# Altium project Discipulo.PrjPcb
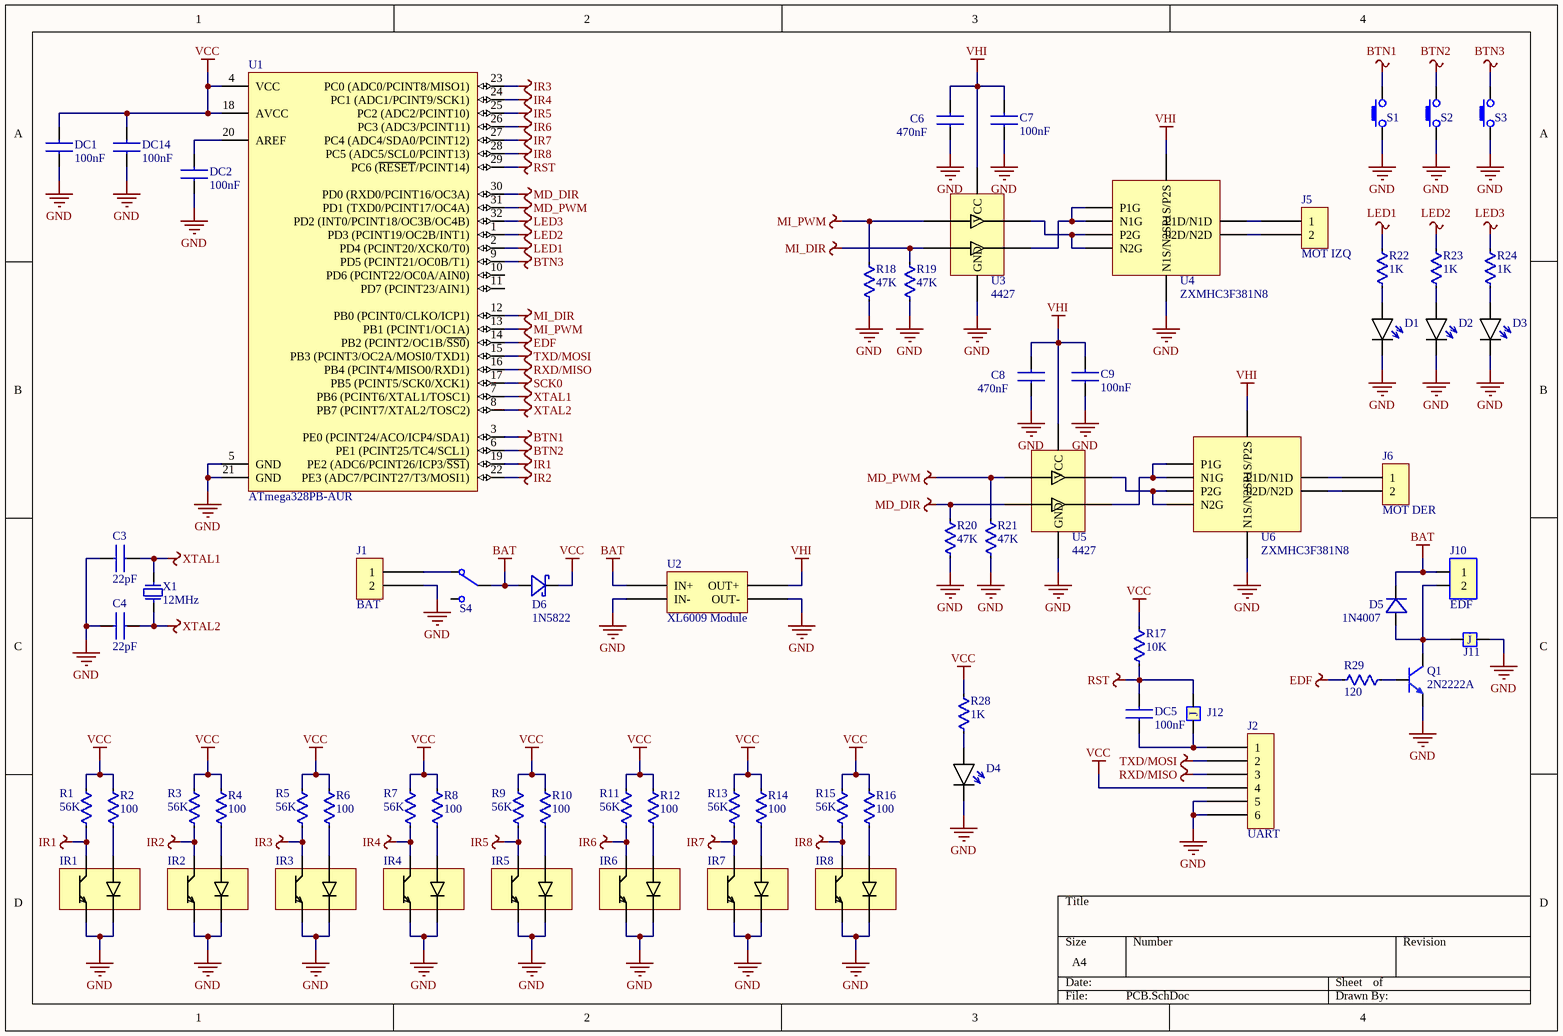
[diagram p0: PCB.SchDoc]
1 sheet, 69 parts. Net scope: global (net labels, ports and power ports of the same name join across sheets).
Board files: PCB.PcbDoc, PCB v2.PcbDoc, PCB v3.PcbDoc

## Sheet PCB.SchDoc
size A4

### Parts
C3  value 22pF  [C1206]  (hidden comment: CAP-CER)
C4  value 22pF  [C1206]  (hidden comment: CAP-CER)
C6  value 470nF  [C1206]  (hidden comment: CAP-CER)
C7  value 100nF  [C1206]  (hidden comment: CAP-CER)
C8  value 470nF  [C1206]  (hidden comment: CAP-CER)
C9  value 100nF  [C1206]  (hidden comment: CAP-CER)
D1  LED  [LED-3MM-YELLOW]  (value not drawn)
D2  LED  [LED-3MM-YELLOW]  (value not drawn)
D3  LED  [LED-3MM-YELLOW]  (value not drawn)
D4  LED  [LED-3MM-RED]  (value not drawn)
D5  NAME: 1N4007  [DO-41]  (hidden comment: DIODE)
D6  1N5822  [DO-41]
DC1  value 100nF  [C1206]  (hidden comment: CAP-CER)
DC2  value 100nF  [C1206]  (hidden comment: CAP-CER)
DC5  value 100nF  [C1206]  (hidden comment: CAP-CER)
DC14  value 100nF  [C1206]  (hidden comment: CAP-CER)
IR1  QRE1113GR  [QRE1113GR]  (value not drawn)
IR2  QRE1113GR  [QRE1113GR]  (value not drawn)
IR3  QRE1113GR  [QRE1113GR]  (value not drawn)
IR4  QRE1113GR  [QRE1113GR]  (value not drawn)
IR5  QRE1113GR  [QRE1113GR]  (value not drawn)
IR6  QRE1113GR  [QRE1113GR]  (value not drawn)
IR7  QRE1113GR  [QRE1113GR]  (value not drawn)
IR8  QRE1113GR  [QRE1113GR]  (value not drawn)
J1  BAT  [HEADER 1x2]
J2  UART  [Header 1x6]
J5  MOT IZQ  [HEADER 1x2]
J6  MOT DER  [HEADER 1x2]
J10  EDF  [BLOCK_TERMINAL-2]
J11  JUMPER  [JUMPER]  (value not drawn)
J12  JUMPER  [JUMPER]  (value not drawn)
Q1  2N2222A  [TO-92]
R1  value 56K  [R1206]  (hidden comment: RES)
R2  value 100  [R1206]  (hidden comment: RES)
R3  value 56K  [R1206]  (hidden comment: RES)
R4  value 100  [R1206]  (hidden comment: RES)
R5  value 56K  [R1206]  (hidden comment: RES)
R6  value 100  [R1206]  (hidden comment: RES)
R7  value 56K  [R1206]  (hidden comment: RES)
R8  value 100  [R1206]  (hidden comment: RES)
R9  value 56K  [R1206]  (hidden comment: RES)
R10  value 100  [R1206]  (hidden comment: RES)
R11  value 56K  [R1206]  (hidden comment: RES)
R12  value 100  [R1206]  (hidden comment: RES)
R13  value 56K  [R1206]  (hidden comment: RES)
R14  value 100  [R1206]  (hidden comment: RES)
R15  value 56K  [R1206]  (hidden comment: RES)
R16  value 100  [R1206]  (hidden comment: RES)
R17  value 10K  [R1206]  (hidden comment: RES)
R18  value 47K  [R1206]  (hidden comment: RES)
R19  value 47K  [R1206]  (hidden comment: RES)
R20  value 47K  [R1206]  (hidden comment: RES)
R21  value 47K  [R1206]  (hidden comment: RES)
R22  value 1K  [R1206]  (hidden comment: RES)
R23  value 1K  [R1206]  (hidden comment: RES)
R24  value 1K  [R1206]  (hidden comment: RES)
R28  value 1K  [R1206]  (hidden comment: RES)
R29  value 120  [R1206]  (hidden comment: RES)
S1  BUTTON  [TACT_SWITCH-SMALL-4PIN]  (value not drawn)
S2  BUTTON  [TACT_SWITCH-SMALL-4PIN]  (value not drawn)
S3  BUTTON  [TACT_SWITCH-SMALL-4PIN]  (value not drawn)
S4  SLIDE-SWITCH  [SWITCH]  (value not drawn)
U1  ATmega328PB-AUR  [32A_M]
U2  XL6009 Module  [XL6009 mdl]
U3  4427  [SOIC-8]
U4  ZXMHC3F381N8  [SOIC-8]
U5  4427  [SOIC-8]
U6  ZXMHC3F381N8  [SOIC-8]
X1  FREQUENCY: 12MHz  [HC-49/S]  (hidden comment: XTAL)

### Nets
BAT: D5.K D6.A J10.1 S4.2 U2.0(IN+)
BTN1: S1.2 U1.3(PE0_(PCINT24/ACO/ICP4/SDA1))
BTN2: S2.2 U1.6(PE1_(PCINT25/TC4/SCL1))
BTN3: S3.2 U1.9(PD5_(PCINT21/OC0B/T1))
EDF: R29.1 U1.14(PB2_(PCINT2/OC1B/~{SS0}))
GND: C3.1 C4.1 C6.1 C7.1 C8.1 C9.1 D1.K D2.K D3.K D4.K DC1.2 DC2.2 DC14.1 IR1.E IR1.K IR2.E IR2.K IR3.E IR3.K IR4.E IR4.K IR5.E IR5.K IR6.E IR6.K IR7.E IR7.K IR8.E IR8.K J1.2 J2.5 J2.6 J11.1 Q1.E R18.1 R19.1 R20.1 R21.1 S1.1 S2.1 S3.1 U1.5(GND) U1.21(GND) U2.1(IN-) U2.2(OUT-) U3.3(GND) U4.3(N1S/N2S) U5.3(GND) U6.3(N1S/N2S)
IR1: IR1.C R1.1 U1.19(PE2_(ADC6/PCINT26/ICP3/~{SS1}))
IR2: IR2.C R3.1 U1.22(PE3_(ADC7/PCINT27/T3/MOSI1))
IR3: IR3.C R5.1 U1.23(PC0_(ADC0/PCINT8/MISO1))
IR4: IR4.C R7.1 U1.24(PC1_(ADC1/PCINT9/SCK1))
IR5: IR5.C R9.1 U1.25(PC2_(ADC2/PCINT10))
IR6: IR6.C R11.1 U1.26(PC3_(ADC3/PCINT11))
IR7: IR7.C R13.1 U1.27(PC4_(ADC4/SDA0/PCINT12))
IR8: IR8.C R15.1 U1.28(PC5_(ADC5/SCL0/PCINT13))
LED1: R22.2 U1.2(PD4_(PCINT20/XCK0/T0))
LED2: R23.2 U1.1(PD3_(PCINT19/OC2B/INT1))
LED3: R24.2 U1.32(PD2_(INT0/PCINT18/OC3B/OC4B))
MD_DIR: R20.2 U1.30(PD0_(RXD0/PCINT16/OC3A)) U5.4(INB)
MD_PWM: R21.2 U1.31(PD1_(TXD0/PCINT17/OC4A)) U5.2(INA)
MI_DIR: R19.2 U1.12(PB0_(PCINT0/CLKO/ICP1)) U3.4(INB)
MI_PWM: R18.2 U1.13(PB1_(PCINT1/OC1A)) U3.2(INA)
RST: DC5.1 J12.1 R17.1 U1.29(PC6_(~{RESET}/PCINT14))
RXD/MISO: J2.3 U1.16(PB4_(PCINT4/MISO0/RXD1))
SCK0: U1.17(PB5_(PCINT5/SCK0/XCK1))
TXD/MOSI: J2.2 U1.15(PB3_(PCINT3/OC2A/MOSI0/TXD1))
VCC: D6.K DC1.1 DC14.2 J2.4 R1.2 R2.2 R3.2 R4.2 R5.2 R6.2 R7.2 R8.2 R9.2 R10.2 R11.2 R12.2 R13.2 R14.2 R15.2 R16.2 R17.2 R28.2 U1.4(VCC) U1.18(AVCC)
VHI: C6.2 C7.2 C8.2 C9.2 U2.3(OUT+) U3.6(VCC) U4.7(P1S/P2S) U5.6(VCC) U6.7(P1S/P2S)
XTAL1: C3.2 U1.7(PB6_(PCINT6/XTAL1/TOSC1)) X1.2
XTAL2: C4.2 U1.8(PB7_(PCINT7/XTAL2/TOSC2)) X1.1
NetD1_A: D1.A R22.1
NetD2_A: D2.A R23.1
NetD3_A: D3.A R24.1
NetD4_A: D4.A R28.1
NetD5_A: D5.A J10.2 J11.2 Q1.C
NetDC2_1: DC2.1 U1.20(AREF)
NetDC5_2: DC5.2 J2.1 J12.2
NetIR1_A: IR1.A R2.1
NetIR2_A: IR2.A R4.1
NetIR3_A: IR3.A R6.1
NetIR4_A: IR4.A R8.1
NetIR5_A: IR5.A R10.1
NetIR6_A: IR6.A R12.1
NetIR7_A: IR7.A R14.1
NetIR8_A: IR8.A R16.1
NetJ1_1: J1.1 S4.1
NetJ5_1: J5.1 U4.2(P1D/N1D)
NetJ5_2: J5.2 U4.6(P2D/N2D)
NetJ6_1: J6.1 U6.2(P1D/N1D)
NetJ6_2: J6.2 U6.6(P2D/N2D)
NetQ1_B: Q1.B R29.2
NetU3_5: U3.5(OUTB) U4.1(N1G) U4.8(P1G)
NetU3_7: U3.7(OUTA) U4.4(N2G) U4.5(P2G)
NetU5_5: U5.5(OUTB) U6.1(N1G) U6.8(P1G)
NetU5_7: U5.7(OUTA) U6.4(N2G) U6.5(P2G)

Not connected (* = marked no-connect by the designer): S4 3; U1 10(PD6_(PCINT22/OC0A/AIN0)) 11(PD7_(PCINT23/AIN1))

### Notes on the sheet
- (in symbol JUMPER) J

### Library data of the parts
D6 = SCHOTTKY: NAME: 1N5819
IR1-IR8 = QRE1113GR: MF: ON Semiconductor; Price: 0.46 USD; MP: QRE1113GR; Package: SMD-4 ON Semiconductor; Availability: Good; Value: *
J1 J5 J6 = Header 1x2
J2 = Header 1x6
J10 = 2-BLOCK_TERMINAL
Q1 = NPN
U1 = ATmega328PB-AUR: 8-bit AVR Microcontroller, 32KB Flash, 1KB EEPROM, 2KB SRAM, 32-pin TQFP, Industrial Grade (-40°C to 85°C), Reel; DatasheetVersion: revD, May-2011; PackageVersion: revC, Oct-2010; PackageReference: 32A; PackageDescription: 32-Lead, 7x7x1.0 mm Body, 0.8mm Lead Pitch, Thin Profile Plastic Quad Flat Package (TQFP); Code_JEDEC: MS-026-ABA; ComponentLink1Description: Manufacturer URL; ComponentLink1URL: http://www.atmel.com/; ComponentLink2Description: ATmega48A/48PA/88A/88PA/168A/168PA/328/328P Datasheet; ComponentLink2URL: http://www.atmel.com/dyn/resources/prod_documents/doc8271.pdf; ComponentLink3Description: ATmega48A/48PA/88A/88PA/168A/168PA/328/328P Summary; ComponentLink3URL: http://www.atmel.com/dyn/resources/prod_documents/8271S.pdf